# Altium schematic sheet Power_BZ_LED_HD.SchDoc
size A3; SheetNumber: 3; SheetTotal: 3
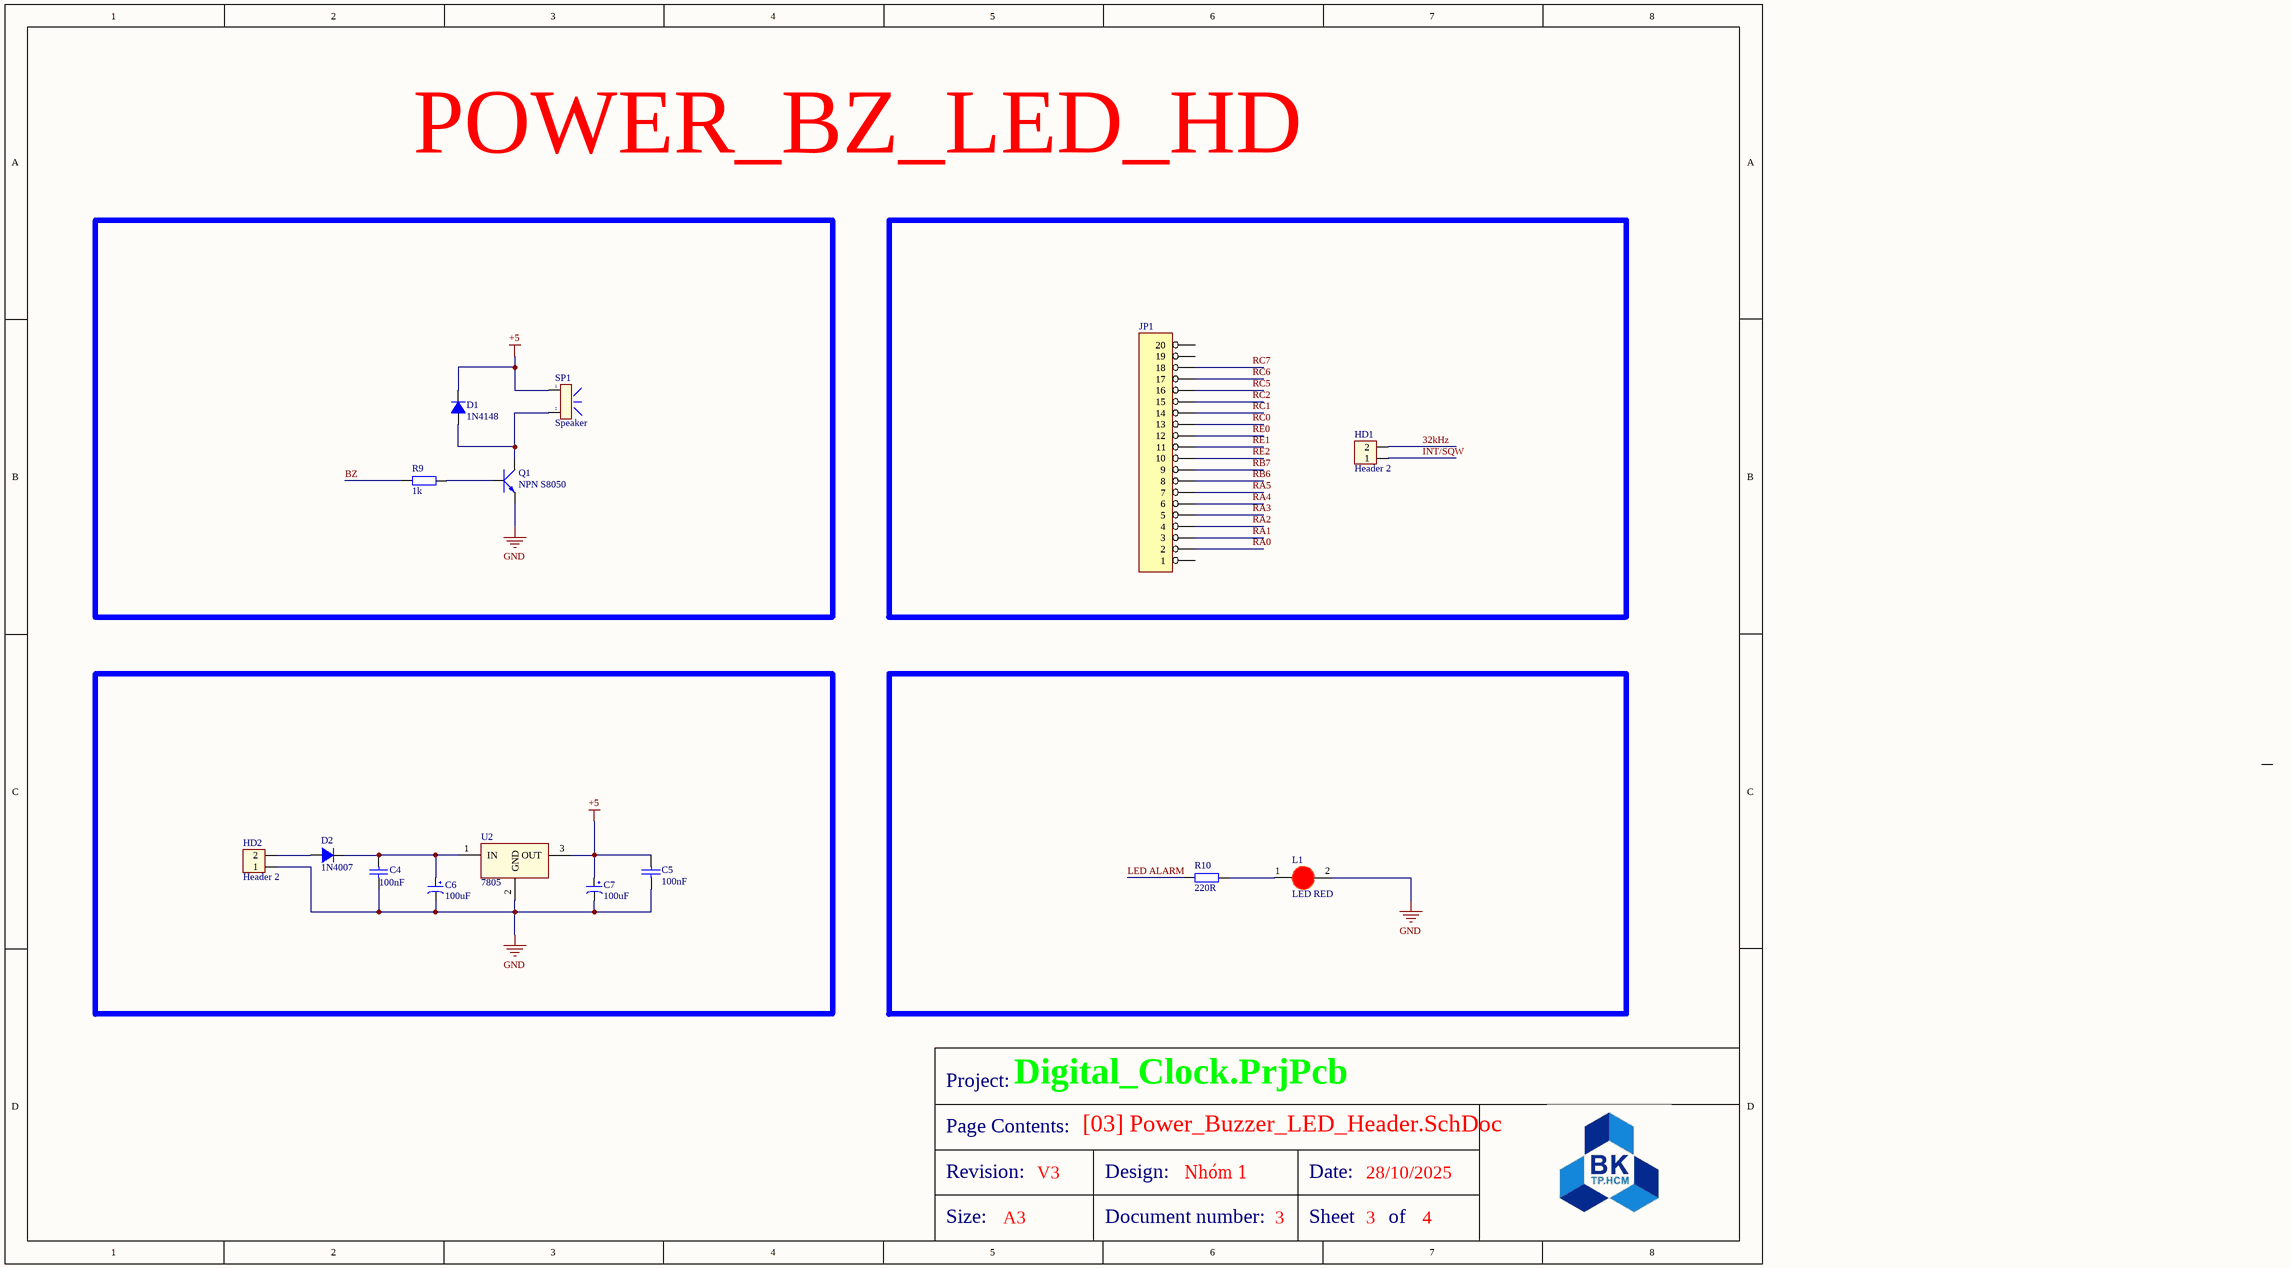
[diagram p0: Power_BZ_LED_HD.SchDoc]

## Parts
C4  100nF  [tu gom]
C5  100nF  [tu gom]
C6  100uF  [tu hoa 6.5mm]
C7  100uF  [tu hoa 6.5mm]
D1  1N4148  [DIODE 0.5A]
D2  1N4007  [DIODE 1A]
HD1  Header 2  [HED2]
HD2  Header 2  [HED2]
JP1  (no value)  [HDR1X20]
L1  LED RED  [LED-5MM-RED]
Q1  NPN S8050  [QTO-92]
R9  1k  [R1/4W]
R10  220R  [tro vach 1/4w]
SP1  Speaker  [SPEAKER]
U2  7805  [QTO-220]

## Nets
+5: C5.1 C7.1 D1.2(K) SP1.1 U2.3(OUT)
GND: C4.2 C5.2 C6.2 C7.2 HD2.1 L1.2(K) Q1.1(E) U2.2(GND)
32kHz: HD1.2
BZ: R9.1
INT/SQW: HD1.1
LED ALARM: R10.1
RA0: JP1.2
RA1: JP1.3
RA2: JP1.4
RA3: JP1.5
RA4: JP1.6
RA5: JP1.7
RB6: JP1.8
RB7: JP1.9
RC0: JP1.13
RC1: JP1.14
RC2: JP1.15
RC5: JP1.16
RC6: JP1.17
RC7: JP1.18
RE0: JP1.12
RE1: JP1.11
RE2: JP1.10
NetC4_1: C4.1 C6.1 D2.2(K) U2.1(IN)
NetD1_1: D1.1(A) Q1.2(C) SP1.2
NetD2_1: D2.1(A) HD2.2
NetL1_1: L1.1(A) R10.2
NetQ1_3: Q1.3(B) R9.2

Not connected (* = marked no-connect by the designer): JP1 1 19 20

## Notes on the sheet
- POWER_BZ_LED_HD
- Project:
- Digital_Clock.PrjPcb
- Page Contents:
- [03] Power_Buzzer_LED_Header.SchDoc
- Revision:
- Size:
- A3
- V3
- Design:
- Document number:
- Nhóm 1
- 3
- Date:
- Sheet
- 28/10/2025
- of
- 4

## Library data of the parts
C4 C5 = Tu gom 22pF 50V: Cắm; Don_Vi: Con; So_Chan: 2; Ten_Linh_Kien: Tụ gốm 22P 50V; Ma_Hang: MH004771; Chung_Loai: Cắm; Kieu_Chan: *
C6 C7 = Tu Hoa 100uF 35V 6x8: Cắm; Don_Vi: Con; So_Chan: 2; Ten_Linh_Kien: Tụ Hóa 100uF 35V; Ma_Hang: MH006862; Chung_Loai: Cắm; Kieu_Chan: *
D1 = Diode 1N4148: Cắm; Ten_Linh_Kien: Diode 1N4148 DO35 450mA 100V ( 1N4148 DIP); Don_Vi: Con; Ma_Hang: MH001065; Ghi Chu: *; Kieu_Chan: *; Chung_Loai: Cắm
D2 = Diode 1N4007: Cắm; Ten_Linh_Kien: Diode 1N4007 1A (DIP); Don_Vi: Con; Ma_Hang: MH001063; Ghi Chu: *; Kieu_Chan: *; Chung_Loai: Cắm
HD1 HD2 = Hed2: Header 2 (Green); Value: Header 2
JP1 = Header 20: Header, 20-Pin, Right Angle
L1 = LED 5mm Do: Cắm; Don_Vi: Con; Ma_Hang: MH008967; Ten_Linh_Kien: Led 5MM Phủ Đỏ (1000c); Ghi_Chu: *; Kieu_Chan: *; Chung_Loai: Cắm
Q1 = NPN_ECB: P 600mW, ECB; Value: C1815
R9 = R1/4W: Resistor 1/4W; Value: R1/4W - 1K
R10 = Tro Vach 1/4W 5% 220R: Cắm; Don_Vi: Con; So_Chan: 2; Ten_Linh_Kien: Trở Vạch 1/4w 5% 220R; Ma_Hang: MH007300; Chung_Loai: Cắm; Kieu_Chan: *
SP1 = SPK: Speaker Chip; Value: Speaker Chip
U2 = LM78xx: On ap +, from + 5 to + 24VDC; Value: LM7805